# EAGLE design motorDriver (EAGLE 7.5.0)
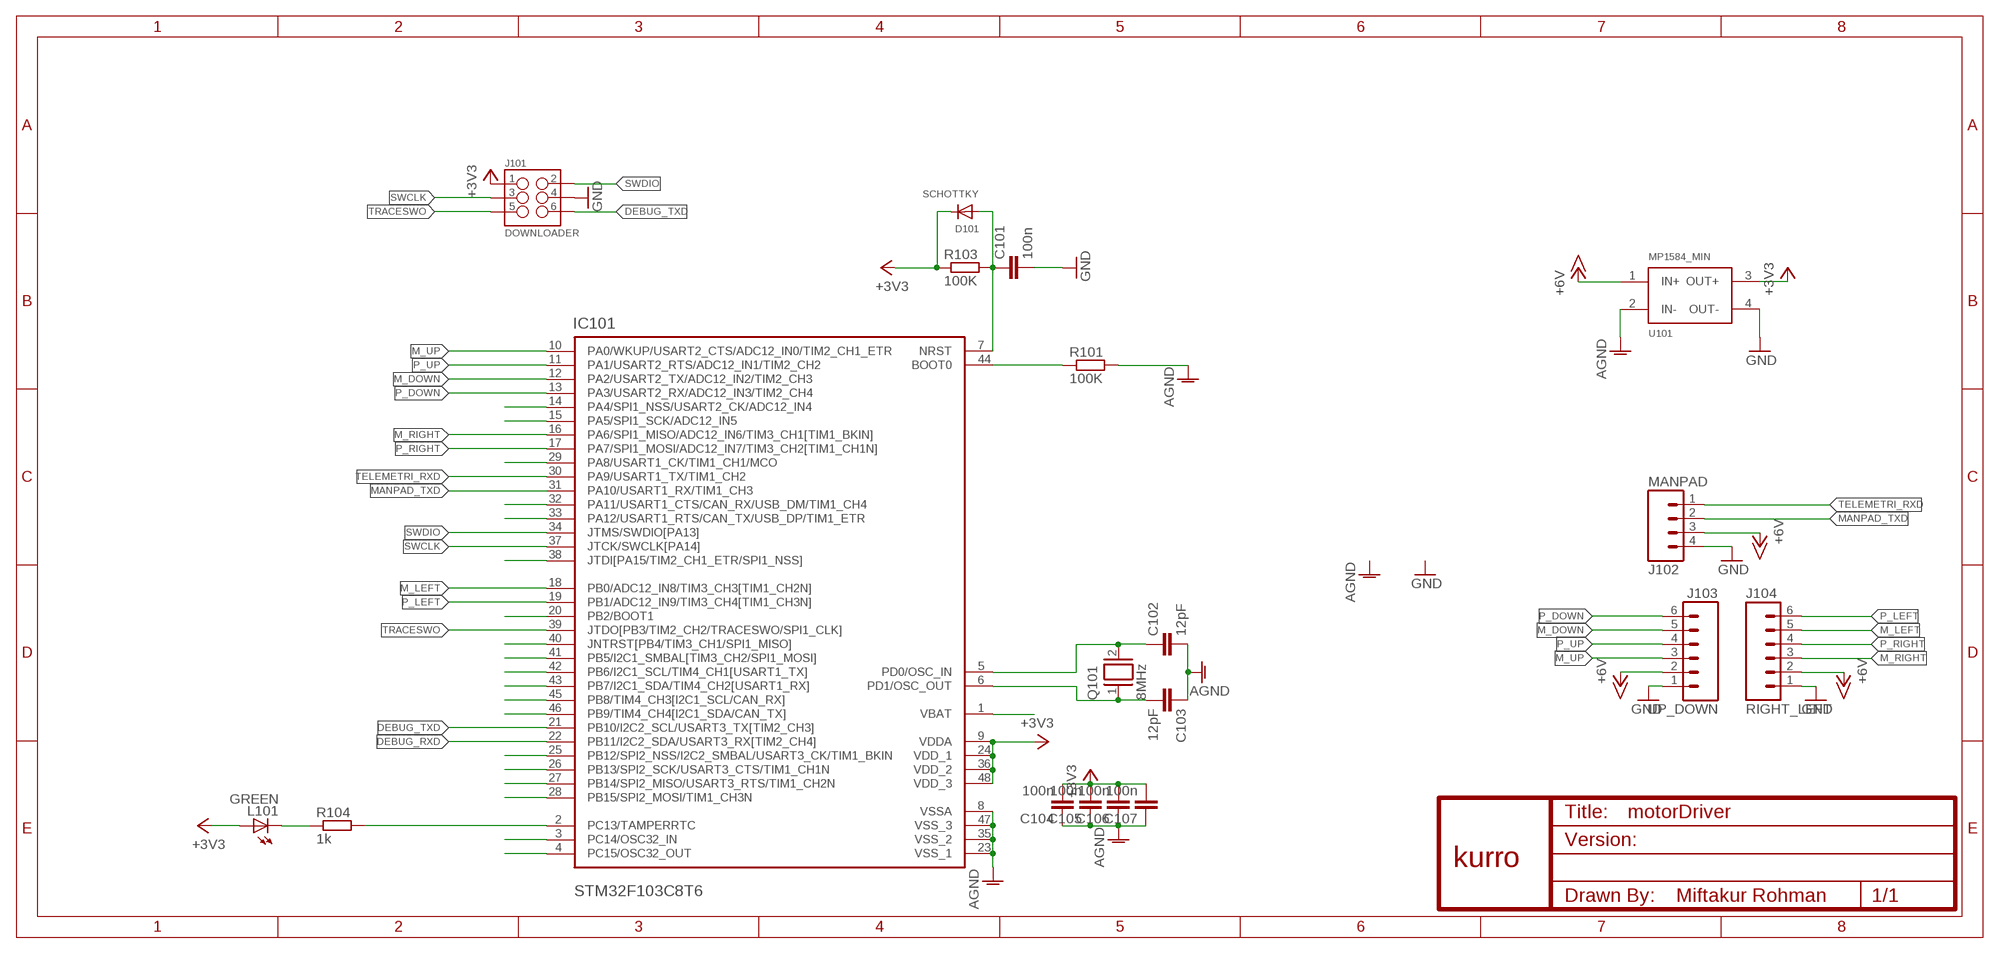
[diagram p0: schematic, sheet 1]

## Parts
C101  100n  C-EUC0603  [C0603]
C102  12pF  C-EUC0603  [C0603]
C103  12pF  C-EUC0603  [C0603]
C104  100n  C-EUC0603  [C0603]
C105  100n  C-EUC0603  [C0603]
C106  100n  C-EUC0603  [C0603]
C107  100n  C-EUC0603  [C0603]
D101  SCHOTTKY  DIODESOD-323F  [SOD-323F]
IC101  STM32F103C8T6  [QFP50P900X900X160-48N]
J101  DOWNLOADER  M03X2  [2X3_SMD]
J102  MANPAD  M04-XH-VERT-SMD  [XH-4-VERT-SMD]
J103  UP_DOWN  M06-XH-VERT-SMD  [XH-6-VERT-SMD]
J104  RIGHT_LEFT  M06-XH-VERT-SMD  [XH-6-VERT-SMD]
L101  GREEN  LEDCHIP-LED0805  [CHIP-LED0805]
Q101  8MHz  XTAL/S  [QS]
R101  100K  R-EU_R0603  [R0603]
R103  100K  R-EU_R0603  [R0603]
R104  1k  R-EU_R0603  [R0603]
U101  MP1584_MIN  [MP1584_MIN]
U$1  KURRO_FOOTPRINT  [KURRO-LOGO]

## Nets
+3V3 [ic]: C104.2 C105.2 C106.2 C107.2 D101.C IC101.9(VDDA) IC101.24(VDD_1) IC101.36(VDD_2) IC101.48(VDD_3) J101.1 L101.A R103.1 U101.3(OUT+)
+6V: J102.3 J103.2 J104.2 U101.1(IN+)
AGND [ic]: C102.2 C103.1 C104.1 C105.1 C106.1 C107.1 IC101.8(VSSA) IC101.23(VSS_1) IC101.35(VSS_2) IC101.47(VSS_3) R101.2 U101.2(IN-)
DEBUG_RXD [ic]: IC101.22(PB11/I2C2_SDA/USART3_RX[TIM2_CH4])
DEBUG_TXD [ic]: IC101.21(PB10/I2C2_SCL/USART3_TX[TIM2_CH3]) J101.6
GND: C101.2 J101.4 J102.4 J103.1 J104.1 U101.4(OUT-)
IMU1_SCL [ic]: IC101.42(PB6/I2C1_SCL/TIM4_CH1[USART1_TX])
IMU1_SDA [ic]: IC101.43(PB7/I2C1_SDA/TIM4_CH2[USART1_RX])
LED1_BUILTIN [ic]: IC101.2(PC13/TAMPERRTC) R104.2
M_DOWN [ic]: IC101.12(PA2/USART2_TX/ADC12_IN2/TIM2_CH3) J103.5
M_LEFT [ic]: IC101.18(PB0/ADC12_IN8/TIM3_CH3[TIM1_CH2N]) J104.5
M_RIGHT [ic]: IC101.16(PA6/SPI1_MISO/ADC12_IN6/TIM3_CH1[TIM1_BKIN]) J104.3
M_UP [ic]: IC101.10(PA0/WKUP/USART2_CTS/ADC12_IN0/TIM2_CH1_ETR) J103.3
MANPAD_TXD [ic]: IC101.31(PA10/USART1_RX/TIM1_CH3) J102.2
N$1 [ic]: IC101.14(PA4/SPI1_NSS/USART2_CK/ADC12_IN4)
N$2 [ic]: IC101.45(PB8/TIM4_CH3[I2C1_SCL/CAN_RX])
N$3 [ic]: IC101.15(PA5/SPI1_SCK/ADC12_IN5)
N$4 [ic]: IC101.44(BOOT0) R101.1
N$5 [ic]: IC101.20(PB2/BOOT1)
N$6 [ic]: C103.2 IC101.6(PD1/OSC_OUT) Q101.1
N$7 [ic]: C102.1 IC101.5(PD0/OSC_IN) Q101.2
N$8 [ic]: IC101.46(PB9/TIM4_CH4[I2C1_SDA/CAN_TX])
N$9 [ic]: L101.C R104.1
N$44 [ic]: IC101.29(PA8/USART1_CK/TIM1_CH1/MCO)
N$45 [ic]: IC101.32(PA11/USART1_CTS/CAN_RX/USB_DM/TIM1_CH4)
N$46 [ic]: IC101.33(PA12/USART1_RTS/CAN_TX/USB_DP/TIM1_ETR)
N$47 [ic]: IC101.38(JTDI[PA15/TIM2_CH1_ETR/SPI1_NSS])
N$50 [ic]: IC101.40(JNTRST[PB4/TIM3_CH1/SPI1_MISO])
N$51 [ic]: IC101.41(PB5/I2C1_SMBAL[TIM3_CH2/SPI1_MOSI])
N$52 [ic]: IC101.25(PB12/SPI2_NSS/I2C2_SMBAL/USART3_CK/TIM1_BKIN)
N$53 [ic]: IC101.26(PB13/SPI2_SCK/USART3_CTS/TIM1_CH1N)
N$54 [ic]: IC101.27(PB14/SPI2_MISO/USART3_RTS/TIM1_CH2N)
N$55 [ic]: IC101.28(PB15/SPI2_MOSI/TIM1_CH3N)
N$56 [ic]: IC101.3(PC14/OSC32_IN)
N$57 [ic]: IC101.4(PC15/OSC32_OUT)
N$58 [ic]: IC101.1(VBAT)
P_DOWN [ic]: IC101.13(PA3/USART2_RX/ADC12_IN3/TIM2_CH4) J103.6
P_LEFT [ic]: IC101.19(PB1/ADC12_IN9/TIM3_CH4[TIM1_CH3N]) J104.6
P_RIGHT [ic]: IC101.17(PA7/SPI1_MOSI/ADC12_IN7/TIM3_CH2[TIM1_CH1N]) J104.4
P_UP [ic]: IC101.11(PA1/USART2_RTS/ADC12_IN1/TIM2_CH2) J103.4
RST [ic]: C101.1 D101.A IC101.7(NRST) R103.2
SWCLK [ic]: IC101.37(JTCK/SWCLK[PA14]) J101.3
SWDIO [ic]: IC101.34(JTMS/SWDIO[PA13]) J101.2
TELEMETRI_RXD [ic]: IC101.30(PA9/USART1_TX/TIM1_CH2) J102.1
TRACESWO [ic]: IC101.39(JTDO[PB3/TIM2_CH2/TRACESWO/SPI1_CLK]) J101.5

## Library data of the parts
C101-C107 = resistor:C-EU: CAPACITOR, European symbol
D101 = adafruit:DIODE: Diode SMADIODE - SMA Surface Mount Package 20V 1A Schottky Diode Digikey: 641-1014-6-ND DO-1N4148 - Through Hole Small Current Diode SOD-123 20V 1 A (.5mV Vf) Schottky Diode - Digikey: MBRX120TPMSCT-ND SOD-323 10V 570mA (.38mV Vf, 3ns) Schottky Diode - Digikey: ZLLS410CT-ND SOD-523 30V 30mA Schottky Diode (RB751S-40TE61) - Digikey: RB751S-40TE61CT-ND SOT23-R/W - SOT23 Package (R = Solder Paste/Reflow Ovens, W = Hand-Soldering) BAT54Film 40V 300mA - Digikey: 497-7162-1-ND
IC101 = ST Microelctronics_By_element14_Batch_1:STM32F103C8T6: Medium-density performance line ARM-based 32-bit MCU; MPN: STM32F103CBT6; OC_FARNELL: 1606327; OC_NEWARK: 11N8296; PACKAGE: QFP-48; SUPPLIER: STMICROELECTRONICS
J101 = SparkFun-Connectors:M03X2: 2x3 .1" header. Shrouded, with keying- CONN-10681 SMT- CONN-11415 Pogo pins- HW-11044; PROD_ID: CONN-11290
J102 = SparkFun-Connectors:M04: Header 4 Standard 4-pin 0.1" header. Use with straight break away headers (SKU : PRT-00116), right angle break away headers (PRT-00553), swiss pins (PRT-00743), machine pins (PRT-00117), and female headers (PRT-00115). Molex polarized connector foot print use with SKU : PRT-08231 with associated crimp pins and housings. 1MM SMD Version SKU: PRT-10208
J103 J104 = SparkFun-Connectors:M06: Header 6 Standard 6-pin 0.1" header. Use with straight break away headers (SKU : PRT-00116), right angle break away headers (PRT-00553), swiss pins (PRT-00743), machine pins (PRT-00117), and female headers (PRT-00115). Molex polarized connector foot print use with SKU : PRT-08094 with associated crimp pins and housings. NOTES ON THE VARIANTS LOCK and LOCK_LONGPADS... This footprint was designed to help hold the alignment of a through-hole component (i.e. 6-pin header) while soldering it into place. You may notice that each hole has been shifted either up or down by 0.005 of an inch from it's more standard position (which is a perfectly straight line). This slight alteration caused the pins (the squares in the middle) to touch the edges of the holes. Because they are alternating, it causes a "brace" to hold the component in place. 0.005 has proven to be the perfect amount of "off-center" position when using our standard breakaway headers. Although looks a little odd when you look at the bare footprint, once you have a header in there, the alteration is very hard to notice. Also,if you push a header all the way into place, it is covered up entirely on the bottom side. This idea of altering the position of holes to aid alignment will be further integrated into the Sparkfun Library for other footprints. It can help hold any component with 3 or more connection pins.
L101 = led:LED: LED OSRAM: - CHIPLED LG R971, LG N971, LY N971, LG Q971, LY Q971, LO R971, LY R971 LH N974, LH R974 LS Q976, LO Q976, LY Q976 LO Q996 - Hyper CHIPLED LW Q18S LB Q993, LB Q99A, LB R99A - SideLED LS A670, LO A670, LY A670, LG A670, LP A670 LB A673, LV A673, LT A673, LW A673 LH A674 LY A675 LS A676, LA A676, LO A676, LY A676, LW A676 LS A679, LY A679, LG A679 - Hyper Micro SIDELED® LS Y876, LA Y876, LO Y876, LY Y876 LT Y87S - SmartLED LW L88C, LW L88S LB L89C, LB L89S, LG L890 LS L89K, LO L89K, LY L89K LS L896, LA L896, LO L896, LY L896 - TOPLED LS T670, LO T670, LY T670, LG T670, LP T670 LSG T670, LSP T670, LSY T670, LOP T670, LYG T670 LG T671, LOG T671, LSG T671 LB T673, LV T673, LT T673, LW T673 LH T674 LS T676, LA T676, LO T676, LY T676, LB T676, LH T676, LSB T676, LW T676 LB T67C, LV T67C, LT T67C, LS T67K, LO T67K, LY T67K, LW E67C LS E67B, LA E67B, LO E67B, LY E67B, LB E67C, LV E67C, LT E67C LW T67C LS T679, LY T679, LG T679 LS T770, LO T770, LY T770, LG T770, LP T770 LB T773, LV T773, LT T773, LW T773 LH T774 LS E675, LA E675, LY E675, LS T675 LS T776, LA T776, LO T776, LY T776, LB T776 LHGB T686 LT T68C, LB T68C - Hyper Mini TOPLED® LB M676 - Mini TOPLED Santana® LG M470 LS M47K, LO M47K, LY M47K Source: http://www.osram.convergy.de LUXEON: - LUMILED® LXK2-PW12-R00, LXK2-PW12-S00, LXK2-PW14-U00, LXK2-PW14-V00 LXK2-PM12-R00, LXK2-PM12-S00, LXK2-PM14-U00 LXK2-PE12-Q00, LXK2-PE12-R00, LXK2-PE12-S00, LXK2-PE14-T00, LXK2-PE14-U00 LXK2-PB12-K00, LXK2-PB12-L00, LXK2-PB12-M00, LXK2-PB14-N00, LXK2-PB14-P00, LXK2-PB14-Q00 LXK2-PR12-L00, LXK2-PR12-M00, LXK2-PR14-Q00, LXK2-PR14-R00 LXK2-PD12-Q00, LXK2-PD12-R00, LXK2-PD12-S00 LXK2-PH12-R00, LXK2-PH12-S00 LXK2-PL12-P00, LXK2-PL12-Q00, LXK2-PL12-R00 Source: www.luxeon.com KINGBRIGHT: KA-3528ASYC Source: www.kingbright.com
Q101 = special:XTAL/S: CRYSTAL
R101 R103 R104 = resistor:R-EU_: RESISTOR, European symbol
U101 = SparkFun-Boards:MP1584
U$1 = SparkFun:KURRO_FOOTPRINT

## Net classes
0 default: width 0.305 mm, drill 0.59 mm, clearance 0.254 mm
1 ic: width 0.254 mm, drill 0.59 mm, clearance 0.203 mm

## Board
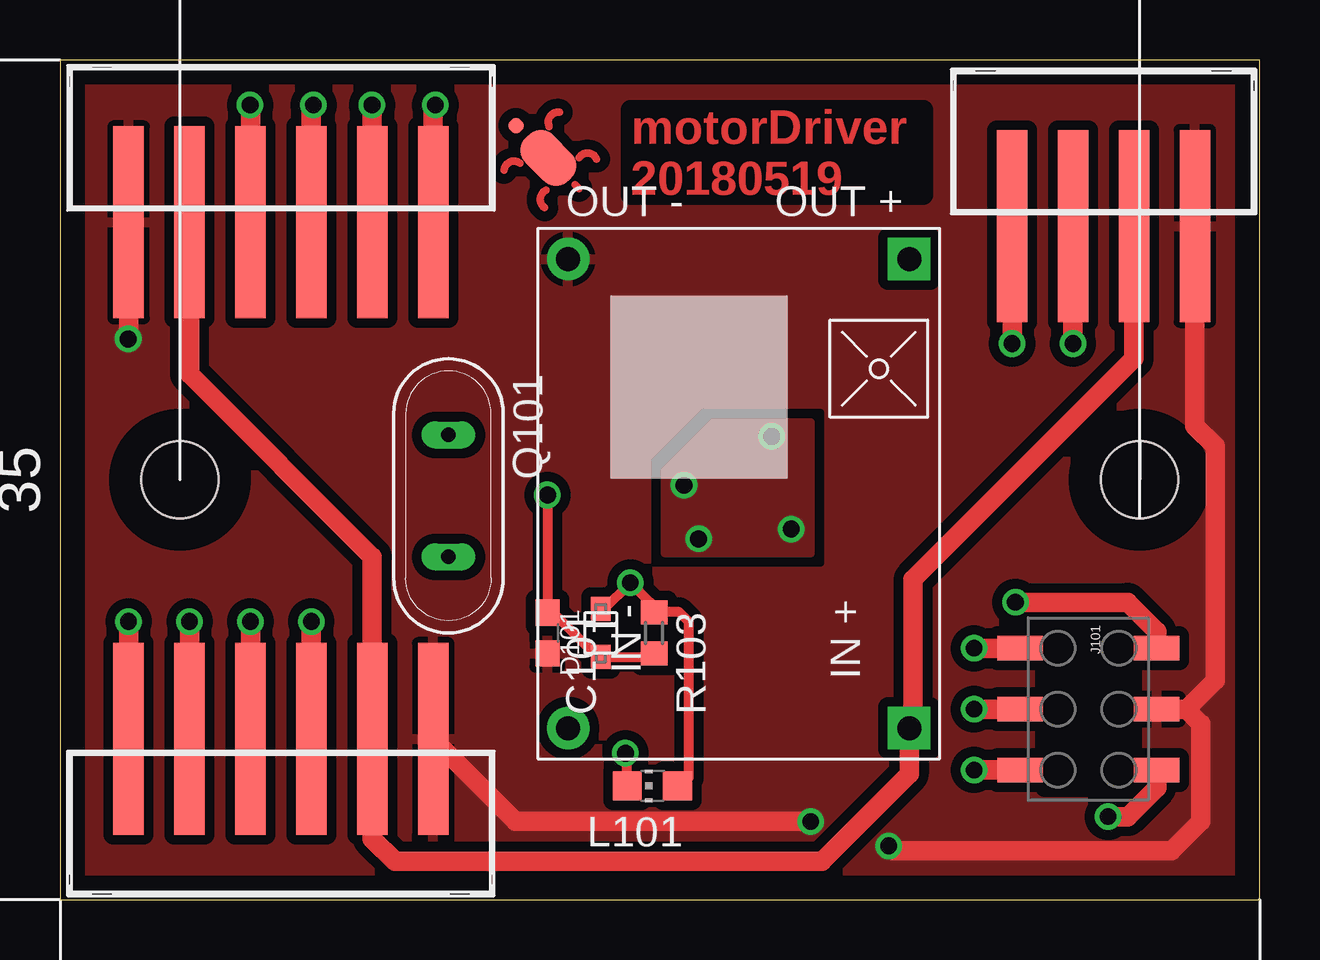
[diagram p1: board, top side]
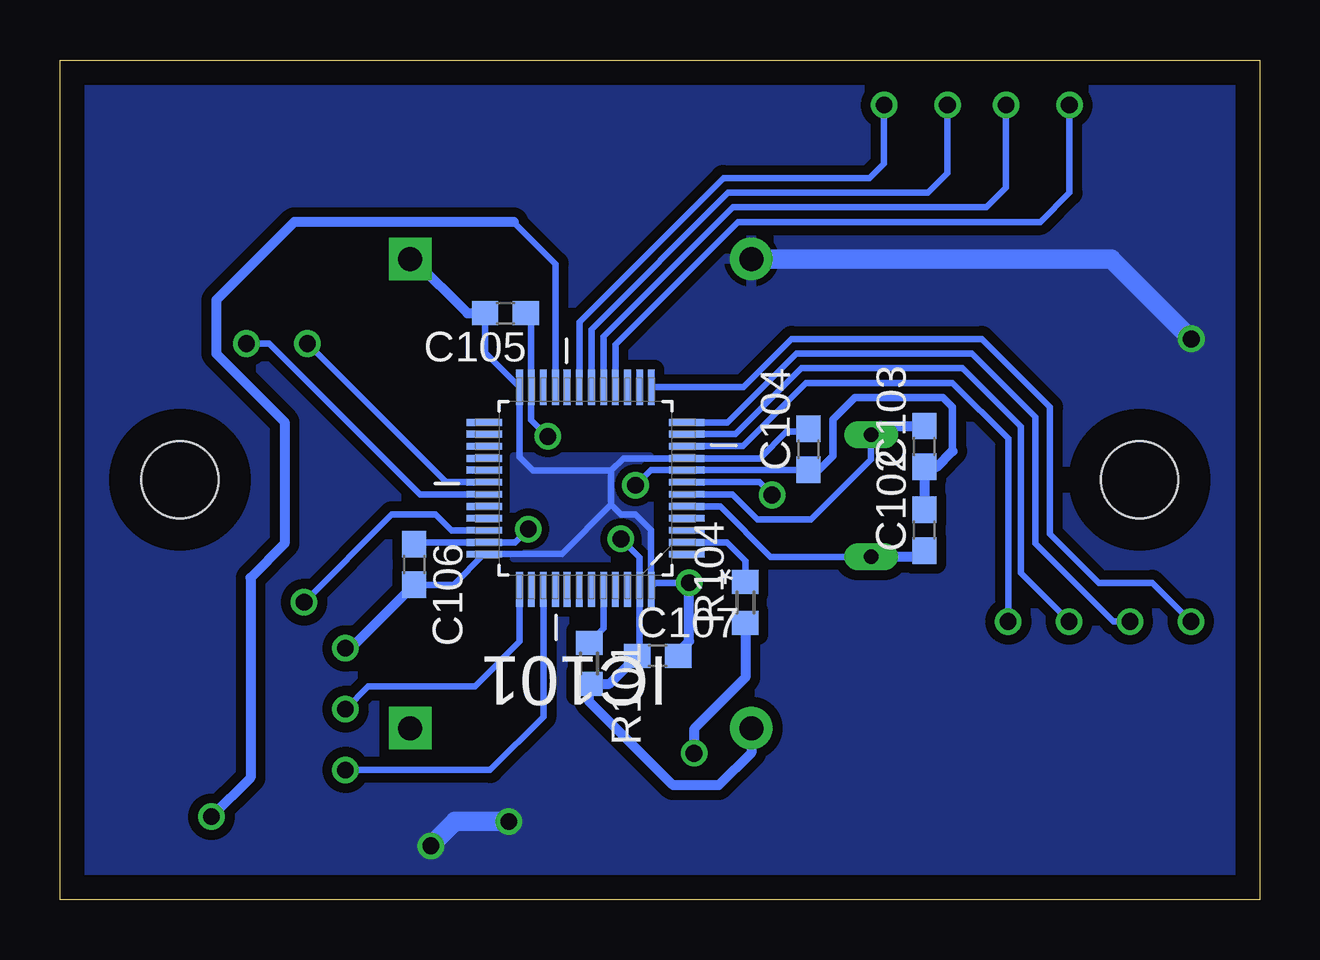
[diagram p2: board, bottom side, seen from below]

Size 50 x 35 mm. Coordinates in mm from the lower left corner, seen from the top.
Outline: 0,0 50,0 50,35 0,35 0,0
Copper layers (1*16): Top 0.035mm / dielectric 1.5mm / Bottom 0.035mm
Design rules "default": minimum track width 10mil, minimum drill 24mil, track to track 8mil, track to pad 8mil, pad to pad 8mil, via to via 8mil, smd to smd 8mil, copper to edge 40mil, drill to drill 8mil, minimum pad ring 10mil, minimum via ring 8mil, stop-mask expansion 4mil, vias tented up to drill 0mil, thermal gap 10mil
Holes 3.2 mm at 5,17.5 45,17.5
tRestrict: area 2.5,15 to 7.5,20; area 42.5,15 to 47.5,20; area 41,4.7 to 44.7,11.2
bRestrict: area 2.5,15 to 7.5,20; area 42.5,15 to 47.5,20

### Footprints (pad centres in the part's own frame; a part is rotated, then mirrored left to right if it is on the bottom)
C0603 = smd 1.1 x 1: 1 -0.85,0; 2 0.85,0
SOD-323F = smd 1 x 0.8: A -1,0; C 1,0
QFP50P900X900X160-48N = smd 1.473 x 0.279: 1 -4.216,2.743; 2 -4.216,2.261; 3 -4.216,1.753; 4 -4.216,1.245; 5 -4.216,0.762; 6 -4.216,0.254; 7 -4.216,-0.254; 8 -4.216,-0.762; 9 -4.216,-1.245; 10 -4.216,-1.753; 11 -4.216,-2.261; 12 -4.216,-2.743; 25 4.216,-2.743; 26 4.216,-2.261; 27 4.216,-1.753; 28 4.216,-1.245; 29 4.216,-0.762; 30 4.216,-0.254; 31 4.216,0.254; 32 4.216,0.762; 33 4.216,1.245; 34 4.216,1.753; 35 4.216,2.261; 36 4.216,2.743 | smd 0.279 x 1.473: 13 -2.743,-4.216; 14 -2.261,-4.216; 15 -1.753,-4.216; 16 -1.245,-4.216; 17 -0.762,-4.216; 18 -0.254,-4.216; 19 0.254,-4.216; 20 0.762,-4.216; 21 1.245,-4.216; 22 1.753,-4.216; 23 2.261,-4.216; 24 2.743,-4.216; 37 2.743,4.216; 38 2.261,4.216; 39 1.753,4.216; 40 1.245,4.216; 41 0.762,4.216; 42 0.254,4.216; 43 -0.254,4.216; 44 -0.762,4.216; 45 -1.245,4.216; 46 -1.753,4.216; 47 -2.261,4.216; 48 -2.743,4.216
2X3_SMD = smd 1.02 x 1.9: 1 -2.54,-2.85; 2 -2.54,2.85; 3 0,-2.85; 4 0,2.85; 5 2.54,-2.85; 6 2.54,2.85
XH-4-VERT-SMD = smd 1.27 x 8: 1 -3.81,-0.5; 2 -1.27,-0.5; 3 1.27,-0.5; 4 3.81,-0.5
XH-6-VERT-SMD = smd 1.27 x 8: 1 -6.35,-0.5; 2 -3.81,-0.5; 3 -1.27,-0.5; 4 1.27,-0.5; 5 3.81,-0.5; 6 6.35,-0.5
CHIP-LED0805 = smd 1.2 x 1.2: A 0,-1.05; C 0,1.05
QS = drill 0.61 long: 1 -2.54,0; 2 2.54,0
R0603 = smd 1 x 1.1: 1 -0.85,0; 2 0.85,0
MP1584_MIN = drill 1 pad 1.778 square: 1 1.27,1.27; 3 20.83,1.27 | drill 1 pad 1.778: 2 1.27,15.49; 4 20.83,15.49
KURRO-LOGO = smd 2.54 x 1.651 rotated 45 bottom: P$1 0,0 | smd 0.635 x 0.635 rotated 45 bottom: P$2 1.347,1.347

### Placement (x,y rotation side)
C101  20.32,11.11 270 top
C102  13.97,15.4 90 bottom
C103  13.97,18.89 90 bottom
C104  18.8,18.77 90 bottom
C105  31.43,24.45 180 bottom
C106  35.24,13.97 270 bottom
C107  25.08,10.16 0 bottom
D101  22.54,11.11 90 top
IC101  28.1,17.14 180 bottom
J101  42.86,7.94 270 top
J102  43.5,28.57 0 top
J103  9.21,6.19 180 top
J104  9.21,28.73 0 top
L101  24.7,4.74 90 top
Q101  16.19,16.83 270 top
R101  27.94,9.84 270 bottom
R103  24.77,11.11 270 top
R104  21.43,12.38 90 bottom
U101  36.67,5.87 90 top
U$1  20.36,30.92 0 bottom

### Tracks (layer width: path | path; a pad name or v marks a point on that pad's centre or on a via)
+3V3  (via drill 0.7)
  Top 0.406: L101.A 25.87,4.74 26.21,5.08 26.21,11.58 25.81,11.99 24.79,11.99 R103.1 24.61,12.11 24.61,12.37 v23.77,13.21 22.68,12.11 D101.C
  Top 0.813: J101.1 v38.1,10.48
  Bottom 0.279: 27.03,17.88 30.28,17.88 30.84,18.45 IC101.24 32.28,22.8 C105.2 | 27.03,16.46 26.62,16.05 26.01,16.05 25.36,15.4 IC101.48 25.36,13.05 25.2,13.21 v23.77,13.21 | 27.03,16.46 27.03,17.88 | 27.03,17.88 26.52,18.39 IC101.9 20.83,18.39 19.71,19.51 18.71,19.51 C104.2 | 27.03,16.46 29.08,14.4 IC101.36 33.6,13.12 C106.2
  Bottom 0.406: U101.3 35.28,26.7 33.02,24.45 C105.2 | C107.2 24.23,10.31 23.77,10.77 v23.77,13.21 | C106.2 37.88,10.48 v38.1,10.48
  pour Bottom (isolate 0.305): 25.4,18.49 31.09,18.49 31.09,14.22 25.4,14.22
+6V
  Top 0.813: J104.2 5.4,21.91 13.02,14.29 J103.2 13.02,2.54 13.97,1.59 31.75,1.59 35.4,5.24 U101.1 35.56,7.3 35.56,13.34 44.77,22.54 J102.3
AGND  (via drill 0.7)
  Bottom 0.279: C107.1 25.84,10.25 IC101.47 25.84,14.26 v26.62,15.04 | v30.48,15.44 31.04,14.88 IC101.35 35.18,14.88 C106.1 | v26.01,17.27 25.38,17.91 IC101.8 18.61,17.91 C104.1 | v29.67,19.3 30.36,20 IC101.23 30.36,24.22 C105.1
  Bottom 0.305: C104.1 18.35,17.92 17.78,18.49 17.78,20.02 16.87,20.93 13.21,20.93 12.8,20.52 12.8,18.69
  Bottom 0.406: C107.1 27.1,8.99 R101.2 27.94,8.26 24.45,4.76 22.54,4.76 21.18,6.12 U101.2 | C102.2 C103.1 13.46,18.04 12.8,18.69
  pour Top (isolate 0.305, rank 2): 25.2,17.88 25.2,14.43 31.29,14.43 31.29,19.91 27.23,19.91
DEBUG_TXD  (via drill 0.7)
  Top 0.813: J101.6 45.71,4.67 44.5,3.45 v43.69,3.45
  Bottom 0.279: IC101.21 29.34,26.5 31.09,28.25
  Bottom 0.406: 31.09,28.25 40.23,28.25 43.48,24.99 43.48,22.76 40.64,19.91 40.64,14.83 42.06,13.41 42.06,5.08 v43.69,3.45
GND  (via drill 0.7)
  Top 0.813: J102.4 47.31,19.75 48.16,18.9 48.16,9.14 46.94,7.92 | 46.94,7.92 45.73,7.92 J101.4 | J104.1 2.86,23.38 v2.85,23.37 | v31.29,3.25 19,3.25 J103.1 | v34.54,2.23 34.75,2.03 46.33,2.03 47.55,3.25 47.55,7.32 46.94,7.92
  Bottom 0.813: U101.4 6.18,26.7 v2.85,23.37 | v31.29,3.25 33.53,3.25 v34.54,2.23
  pour Top (isolate 0.406, rank 6): 0,0 50,0 50,35 0,35
  pour Bottom (isolate 0.406, rank 6): 0,0 50,0 50,35 0,35
LED1_BUILTIN
  Bottom 0.279: IC101.2 22.2,14.88 21.43,14.12 R104.2
M_DOWN  (via drill 0.7)
  Top 0.813: J103.5 v5.4,11.59
  Bottom 0.279: IC101.12 22.17,19.89 19.3,22.76 11.99,22.76 9.35,20.12 9.35,14.83 6.1,11.59 v5.4,11.59
M_LEFT  (via drill 0.7)
  Top 0.813: J104.5 13.02,33.11 v13.01,33.12
  Bottom 0.279: IC101.18 27.84,23.77 22.15,29.46 13.82,29.46 13.01,30.28 v13.01,33.12
M_RIGHT  (via drill 0.7)
  Top 0.813: J104.3 7.94,33.11 v7.92,33.12
  Bottom 0.279: IC101.16 26.85,23.13 21.74,28.25 9.14,28.25 7.92,29.46 v7.92,33.12
M_UP  (via drill 0.7)
  Top 0.813: J103.3 v10.48,11.59
  Bottom 0.279: IC101.10 21.54,18.9 19.51,20.93 18.9,21.54 12.8,21.54 10.48,19.21 v10.48,11.59
MANPAD_TXD  (via drill 0.7)
  Top 0.813: J102.2 v42.23,23.18
  Bottom 0.279: IC101.31 34.99,16.89 41.27,23.18 v42.23,23.18
N$4
  Bottom 0.279: IC101.44 27.34,11.3 R101.1
N$6
  Bottom 0.279: IC101.6 21.97,16.89 20.93,15.85 18.69,15.85 16.19,18.35 Q101.1
  Bottom 0.406: Q101.1 15.82,19.74 C103.2
N$7
  Bottom 0.279: IC101.5 22.48,16.38 20.38,14.29 Q101.2
  Bottom 0.406: C102.1 14.23,14.29 Q101.2
N$9  (via drill 0.7)
  Top 0.406: L101.C 23.64,6.02 v23.57,6.1
  Bottom 0.406: R104.1 21.43,9.25 23.57,7.11 v23.57,6.1
P_DOWN  (via drill 0.7)
  Top 0.813: J103.6 v2.86,11.59
  Bottom 0.279: IC101.13 21.51,21.36 19.51,23.37 11.58,23.37 8.74,20.52 8.74,15.24 6.71,13.21 4.48,13.21 v2.86,11.59
P_LEFT  (via drill 0.7)
  Top 0.813: J104.6 15.56,33.03 v15.65,33.12
  Bottom 0.279: IC101.19 28.35,24.07 22.35,30.07 16.26,30.07 15.65,30.68 v15.65,33.12
P_RIGHT  (via drill 0.7)
  Top 0.813: J104.4 10.48,33.03 v10.57,33.12
  Bottom 0.279: IC101.17 27.34,23.46 21.95,28.85 11.38,28.85 10.57,29.67 v10.57,33.12
P_UP  (via drill 0.7)
  Top 0.813: J103.4 v7.94,11.59
  Bottom 0.279: IC101.11 21.84,19.41 19.1,22.15 12.39,22.15 9.96,19.71 9.96,13.61 v7.94,11.59
RST  (via drill 0.7)
  Top 0.406: R103.2 24.61,10.11 D101.A 22.4,10.11 20.55,11.96 C101.1 v20.32,16.87
  Bottom 0.279: IC101.7 20.85,17.4 v20.32,16.87
SWCLK  (via drill 0.7)
  Top 0.813: J101.3 v38.1,7.94
  Bottom 0.279: IC101.37 30.84,10.75 32.7,8.89 37.15,8.89 v38.1,7.94
SWDIO  (via drill 0.7)
  Top 0.813: v39.83,12.39 44.5,12.39 45.71,11.18 J101.2
  Bottom 0.279: IC101.34 33.68,15.39 34.34,16.05 36.17,16.05 v39.83,12.39
TELEMETRI_RXD  (via drill 0.7)
  Top 0.813: J102.1 v39.69,23.18
  Bottom 0.279: IC101.30 33.91,17.4 v39.69,23.18
TRACESWO  (via drill 0.7)
  Top 0.813: J101.5 v38.1,5.4
  Bottom 0.279: IC101.39 29.85,7.61 32.07,5.4 v38.1,5.4

### Text on the board
Top: motorDriver / 20180519